# Altium schematic sheet REVISION HISTORY.SchDoc
size A3; SheetNumber: 1; SheetTotal: 5
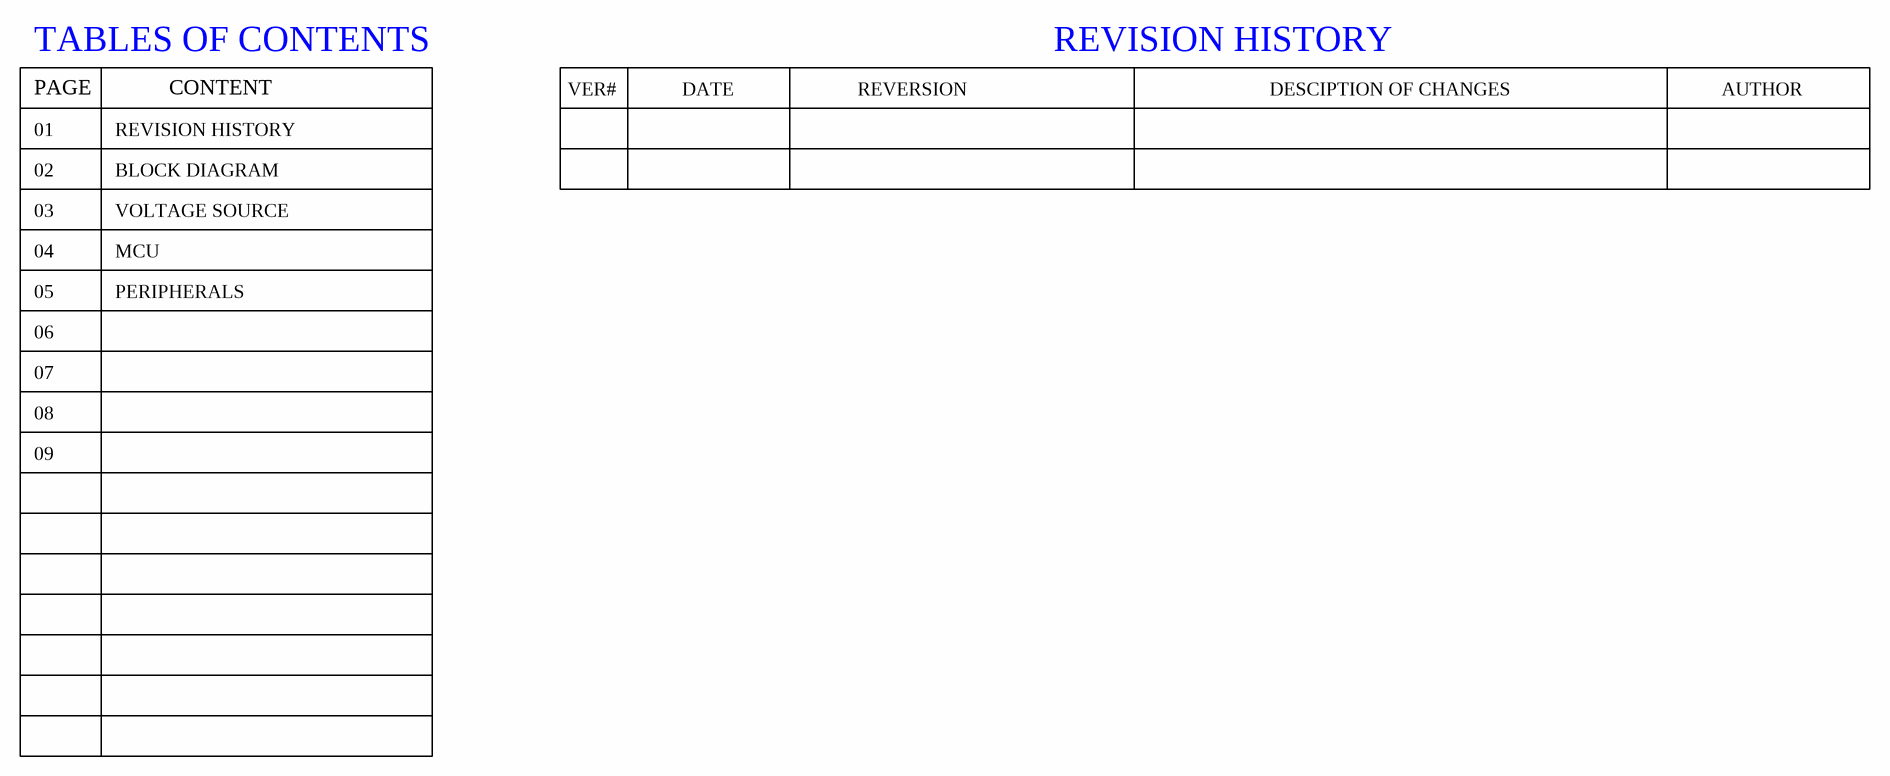
[diagram p0: REVISION HISTORY.SchDoc]

## Notes on the sheet
- TABLES OF CONTENTS
- PAGE
- CONTENT
- VER#
- DATE
- REVERSION
- REVISION HISTORY
- DESCIPTION OF CHANGES
- AUTHOR
- 01
- 02
- 03
- BLOCK DIAGRAM
- VOLTAGE SOURCE
- 04
- MCU
- 05
- 06
- PERIPHERALS
- 07
- 08
- 09
- Author:
- Title:
- Size:
- A3
- Project:
- Revision:
- Modified Date:
- CheckedBy:
- Date:
- SW Version: